# Altium schematic sheet Schematic.SchDoc
size A; SheetNumber: 1; SheetTotal: 1
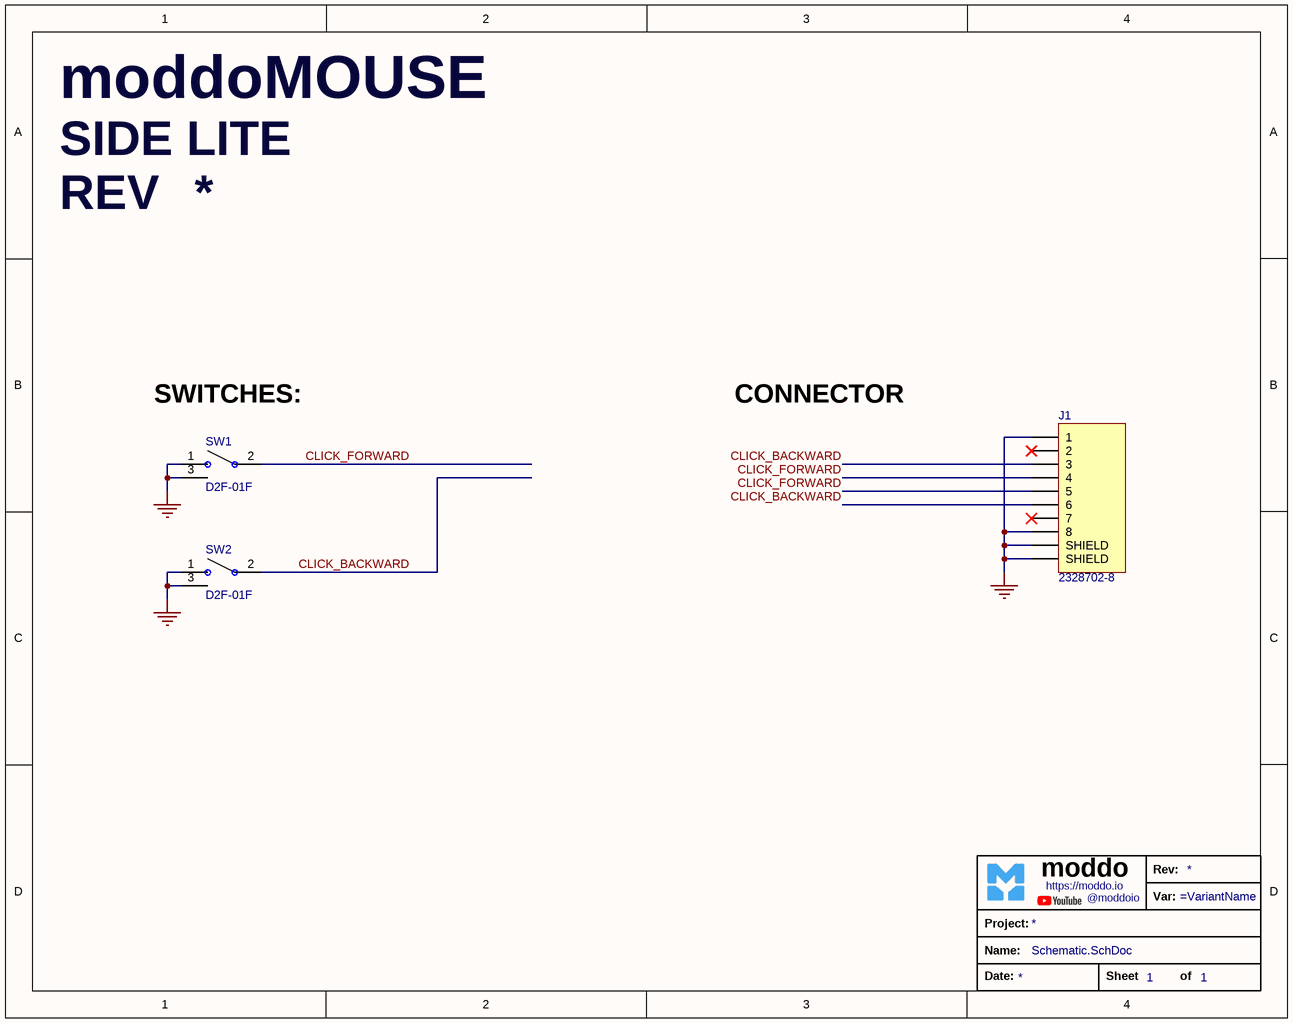
[diagram p0: Schematic.SchDoc]

## Parts
?  TitleBlock_moddo  (value not drawn)  (graphical)
J1  2328702-8  [2328702-8]
SW1  D2F-01F  [Microswitch]
SW2  D2F-01F  [Microswitch]

## Nets
GND: J1.1 J1.8 J1.S1(SHIELD) J1.S2(SHIELD) SW1.1 SW1.3 SW2.1 SW2.3
CLICK_BACKWARD: J1.3 J1.6 SW2.2
CLICK_FORWARD: J1.4 J1.5 SW1.2

Not connected (* = marked no-connect by the designer): J1 2* 7*

## Notes on the sheet
- moddoMOUSE <https://protorig.io/>
- SIDE LITE <https://protorig.io/>
- REV
- SWITCHES:
- CONNECTOR
- (in symbol TitleBlock_moddo) Rev:; moddo; https://moddo.io; Var:; @moddoio; Project:; Name:; Date:; Sheet; of

## Library data of the parts
J1 = 2328702-8: FFC/FPC Connector, 8 Contact(s), 1 Row(s), Right Angle, Solder Terminal, Natural Insulator; Manufacturer: TE Connectivity; Actuator Material: Thermoplastic; Actuator Color: Black; Plating: Gold; Number of Positions: 8; Voltage Rating: 50V; Connector System: Wire-to-Board; Gender: Receptacle; Sealable: No (Without); Supplier 1: Arrow Electronics; Manufacturer Part Number: 2328702-8; RoHS: Yes; Category: FFC / FPC; Stock 1: 56000; Pricing 1: 28000=0.0961 (USD); Mounting Technology: Surface Mount; Contact Material: Copper Alloy; Contact Plating: Gold; Housing Material: Thermoplastic; Housing Color: Natural; Min Operating Temperature: -40°C; Max Operating Temperature: 85°C; Packaging: Cut Tape; Termination: Solder; Series: -; Number of Contacts: 8; Number of Rows: 1; Operating Supply Voltage: 50V; Orientation: Right Angle; Length: 6mm; Height: 1mm; Flammability Rating: UL94 V-0; ComponentLink1URL: https://www.te.com/commerce/DocumentDelivery/DDEController?Action=srchrtrv&amp;DocNm=2328702&amp;DocType=Customer+Drawing&amp;DocLang=English&src-supplier=Digikey; ComponentLink1Description: https://www.te.com/commerce/DocumentDelivery/DDEController?Action=srchrtrv&amp;DocNm=2328702&amp;DocType=Customer+Drawing&amp;DocLang=English&src-supplier=Digikey; Supplier Part Number 1: 2328702-8
SW1 SW2 = Microswitch: SWITCH SNAP ACTION SPDT 0.1A 30V; Manufacturer: Omron Electronics Inc-EMC Div; Manufacturer Part Number: D2F-01F